# Altium schematic sheet [02] MCU.SchDoc
size A4; ApprovedBy: Laert Ferreira; Author: Deived Azevedo; CompanyName: Metro Rio; SheetNumber: 3; CurrentDate: 01/07/2024; ProjectName: CoreBoard
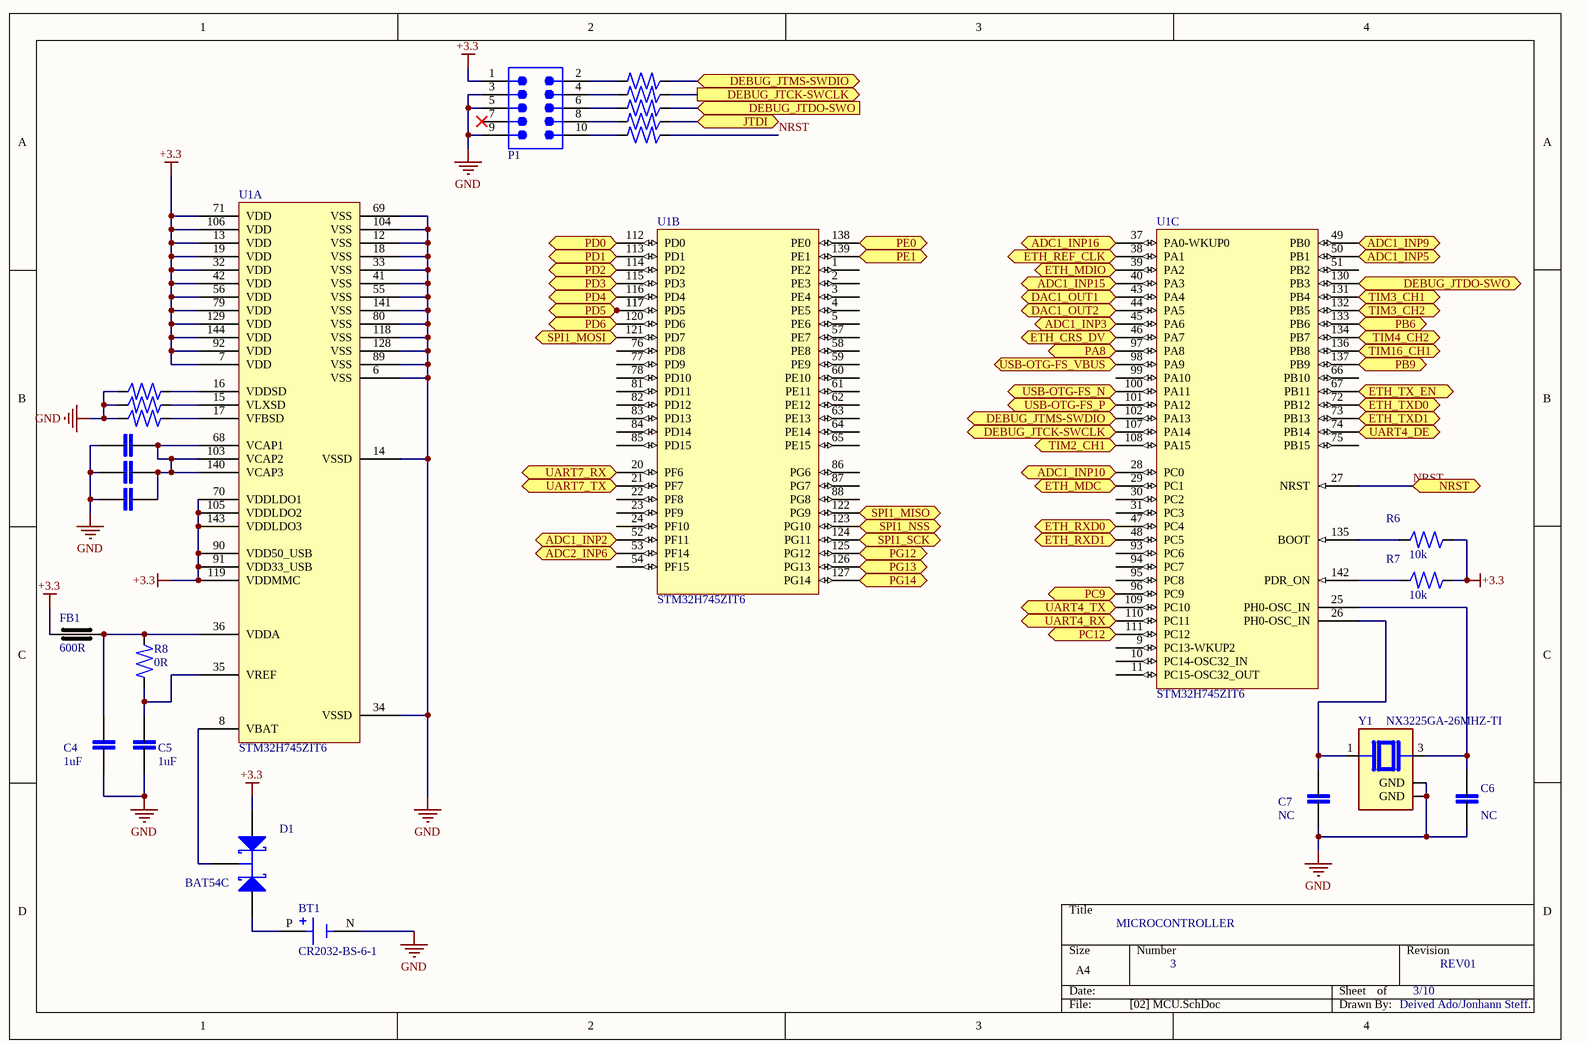
[diagram p0: [02] MCU.SchDoc]

## Parts
BT1  CR2032-BS-6-1  [BAT_CR2032-BS-6-1]
C1  2.2uF  [cap_0603]  (value not drawn)
C2  2.2uF  [cap_0603]  (value not drawn)
C3  2.2uF  [cap_0603]  (value not drawn)
C4  1uF  [cap_0603]
C5  1uF  [cap_0603]
C6  NC  [cap_0603]
C7  NC  [cap_0603]
D1  BAT54C  [SOT23_N]
FB1  600R  [cap_0603]
P1  62701020621  [SAMTEC-FTS-105-03-X-DV]  (value not drawn)
R1  22R  [RES_0603]  (value not drawn)
R2  22R  [RES_0603]  (value not drawn)
R3  22R  [RES_0603]  (value not drawn)
R4  22R  [RES_0603]  (value not drawn)
R5  22R  [RES_0603]  (value not drawn)
R6  10k  [res_0603]
R7  10k  [res_0603]
R8  0R  [res_0603]
R37  0R  [res_0603]  (value not drawn)
R38  0R  [res_0603]  (value not drawn)
R39  0R  [res_0603]  (value not drawn)
U1  STM32H745ZIT6  [LQFP144]  (parts A,B,C of 3)
Y1  NX3225GA-26MHZ-TI  [XTAL_NX3225SA-25.000M-STD-CRS-2]

## Ports
ADC1_INP2 (in), ADC1_INP3, ADC1_INP5 (in), ADC1_INP9 (in), ADC1_INP10 (in), ADC1_INP15, ADC1_INP16, ADC2_INP6 (in), DAC1_OUT1 (out), DAC1_OUT2 (out), DEBUG_JTCK-SWCLK (in), DEBUG_JTCK-SWCLK (out), DEBUG_JTDO-SWO (in), DEBUG_JTDO-SWO (out), DEBUG_JTMS-SWDIO, DEBUG_JTMS-SWDIO (bidir), ETH_CRS_DV, ETH_MDC (out), ETH_MDIO (bidir), ETH_REF_CLK (in), ETH_RXD0 (bidir), ETH_RXD1 (bidir), ETH_TX_EN (out), ETH_TXD0 (out), ETH_TXD1 (out), JTDI, NRST, PA8 (bidir), PB6 (bidir), PB9 (bidir), PC9 (bidir), PC12 (bidir), PD0 (bidir), PD1 (bidir), PD2 (bidir), PD3 (bidir), PD4 (bidir), PD5 (bidir), PD6 (bidir), PE0 (bidir), PE1 (bidir), PG12 (bidir), PG13 (bidir), PG14 (bidir), SPI1_MISO (in), SPI1_MOSI (out), SPI1_NSS (out), SPI1_SCK (out), TIM2_CH1 (out), TIM3_CH1 (out), TIM3_CH2 (out), TIM4_CH2 (out), TIM16_CH1 (out), UART4_DE (out), UART4_RX (in), UART4_TX (out), UART7_RX (in), UART7_TX (out), USB-OTG-FS_N (bidir), USB-OTG-FS_P (bidir), USB-OTG-FS_VBUS

## Nets
+3.3: D1.2(A2) FB1.1 P1.1 R6.1 R7.1 U1.7(VDD) U1.13(VDD) U1.19(VDD) U1.32(VDD) U1.42(VDD) U1.56(VDD) U1.70(VDDLDO1) U1.71(VDD) U1.79(VDD) U1.90(VDD50_USB) U1.91(VDD33_USB) U1.92(VDD) U1.105(VDDLDO2) U1.106(VDD) U1.119(VDDMMC) U1.129(VDD) U1.143(VDDLDO3) U1.144(VDD)
GND: BT1.N(NEG) C1.1 C2.1 C3.1 C4.1 C5.1 C6.1 C7.1 P1.3 P1.5 P1.9 R37.2 R38.2 R39.2 U1.6(VSS) U1.12(VSS) U1.14(VSSD) U1.18(VSS) U1.33(VSS) U1.34(VSSD) U1.41(VSS) U1.55(VSS) U1.69(VSS) U1.80(VSS) U1.89(VSS) U1.104(VSS) U1.118(VSS) U1.128(VSS) U1.141(VSS) Y1.2(GND) Y1.4(GND)
ADC1_INP2: U1.52(PF11) ; port ADC1_INP2
ADC1_INP3: U1.45(PA6) ; port ADC1_INP3
ADC1_INP5: U1.50(PB1) ; port ADC1_INP5
ADC1_INP9: U1.49(PB0) ; port ADC1_INP9
ADC1_INP10: U1.28(PC0) ; port ADC1_INP10
ADC1_INP15: U1.40(PA3) ; port ADC1_INP15
ADC1_INP16: U1.37(PA0-WKUP0) ; port ADC1_INP16
ADC2_INP6: U1.53(PF14) ; port ADC2_INP6
DAC1_OUT1: U1.43(PA4) ; port DAC1_OUT1
DAC1_OUT2: U1.44(PA5) ; port DAC1_OUT2
DEBUG_JTCK-SWCLK: R2.2 U1.107(PA14) ; port DEBUG_JTCK-SWCLK
DEBUG_JTDO-SWO: R3.2 U1.130(PB3) ; port DEBUG_JTDO-SWO
DEBUG_JTMS-SWDIO: R1.2 U1.102(PA13) ; port DEBUG_JTMS-SWDIO
ETH_CRS_DV: U1.46(PA7) ; port ETH_CRS_DV
ETH_MDC: U1.29(PC1) ; port ETH_MDC
ETH_MDIO: U1.39(PA2) ; port ETH_MDIO
ETH_REF_CLK: U1.38(PA1) ; port ETH_REF_CLK
ETH_RXD0: U1.47(PC4) ; port ETH_RXD0
ETH_RXD1: U1.48(PC5) ; port ETH_RXD1
ETH_TX_EN: U1.67(PB11) ; port ETH_TX_EN
ETH_TXD0: U1.72(PB12) ; port ETH_TXD0
ETH_TXD1: U1.73(PB13) ; port ETH_TXD1
JTDI: R4.2 ; port JTDI
NRST: R5.2 U1.27(NRST) ; port NRST
PA8: U1.97(PA8) ; port PA8
PB6: U1.133(PB6) ; port PB6
PB9: U1.137(PB9) ; port PB9
PC9: U1.96(PC9) ; port PC9
PC12: U1.111(PC12) ; port PC12
PD0: U1.112(PD0) ; port PD0
PD1: U1.113(PD1) ; port PD1
PD2: U1.114(PD2) ; port PD2
PD3: U1.115(PD3) ; port PD3
PD4: U1.116(PD4) ; port PD4
PD5: U1.117(PD5) ; port PD5
PD6: U1.120(PD6) ; port PD6
PE0: U1.138(PE0) ; port PE0
PE1: U1.139(PE1) ; port PE1
PG12: U1.125(PG12) ; port PG12
PG13: U1.126(PG13) ; port PG13
PG14: U1.127(PG14) ; port PG14
SPI1_MISO: U1.122(PG9) ; port SPI1_MISO
SPI1_MOSI: U1.121(PD7) ; port SPI1_MOSI
SPI1_NSS: U1.123(PG10) ; port SPI1_NSS
SPI1_SCK: U1.124(PG11) ; port SPI1_SCK
TIM2_CH1: U1.108(PA15) ; port TIM2_CH1
TIM3_CH1: U1.131(PB4) ; port TIM3_CH1
TIM3_CH2: U1.132(PB5) ; port TIM3_CH2
TIM4_CH2: U1.134(PB7) ; port TIM4_CH2
TIM16_CH1: U1.136(PB8) ; port TIM16_CH1
UART4_DE: U1.74(PB14) ; port UART4_DE
UART4_RX: U1.110(PC11) ; port UART4_RX
UART4_TX: U1.109(PC10) ; port UART4_TX
UART7_RX: U1.20(PF6) ; port UART7_RX
UART7_TX: U1.21(PF7) ; port UART7_TX
USB-OTG-FS_N: U1.100(PA11) ; port USB-OTG-FS_N
USB-OTG-FS_P: U1.101(PA12) ; port USB-OTG-FS_P
USB-OTG-FS_VBUS: U1.98(PA9) ; port USB-OTG-FS_VBUS
NetBT1_P: BT1.P(POS) D1.1(A1)
NetC1_2: C1.2 C2.2 C3.2 U1.68(VCAP1) U1.103(VCAP2) U1.140(VCAP3)
NetC4_2: C4.2 FB1.2 R8.2 U1.36(VDDA)
NetC5_2: C5.2 R8.1 U1.35(VREF)
NetC6_2: C6.2 U1.25(PH0-OSC_IN) Y1.3
NetC7_2: C7.2 U1.26(PH0-OSC_IN) Y1.1
NetD1_3: D1.3(K) U1.8(VBAT)
NetP1_2: P1.2 R1.1
NetP1_4: P1.4 R2.1
NetP1_6: P1.6 R3.1
NetP1_8: P1.8 R4.1
NetP1_10: P1.10 R5.1
NetR6_2: R6.2 U1.135(BOOT)
NetR7_2: R7.2 U1.142(PDR_ON)
NetR37_1: R37.1 U1.16(VDDSD)
NetR38_1: R38.1 U1.15(VLXSD)
NetR39_1: R39.1 U1.17(VFBSD)

Not connected (* = marked no-connect by the designer): P1 7*; U1 1(PE2) 2(PE3) 3(PE4) 4(PE5) 5(PE6) 9(PC13-WKUP2) 10(PC14-OSC32_IN) 11(PC15-OSC32_OUT) 22(PF8) 23(PF9) 24(PF10) 30(PC2) 31(PC3) 51(PB2) 54(PF15) 57(PE7) 58(PE8) 59(PE9) 60(PE10) 61(PE11) 62(PE12) 63(PE13) 64(PE14) 65(PE15) 66(PB10) 75(PB15) 76(PD8) 77(PD9) 78(PD10) 81(PD11) 82(PD12) 83(PD13) 84(PD14) 85(PD15) 86(PG6) 87(PG7) 88(PG8) 93(PC6) 94(PC7) 95(PC8) 99(PA10)

## Notes on the sheet
- MICROCONTROLLER
- 3
- 3/10
- REV01
- Deived Ado/Jonhann Steff.

## Library data of the parts
BT1 = CR2032-BS-6-1: Battery base CR2032 SMD Battery Connectors ROHS; MF: Shenzhen Q&J Electronics Co. Ltd; Package: Package; Check_prices: https://www.snapeda.com/parts/CR2032-BS-6-1/Shenzhen+Q%2526J+Electronics+Co.+Ltd/view-part/?ref=eda; SnapEDA_Link: https://www.snapeda.com/parts/CR2032-BS-6-1/Shenzhen+Q%2526J+Electronics+Co.+Ltd/view-part/?ref=snap; MP: CR2032-BS-6-1; Value: *; Availability: Not in stock; Price: None
C1-C7 = C_Small: Generic capacitor symbol
D1 = BAT54C: Schottky Barrier Double Diode; Published: 17-Sep-2003; LatestRevisionDate: 12-Dec-2006; LatestRevisionNote: IPC-7351 Footprint Added.; DatasheetVersion: 4-Mar-2002; PackageVersion: May-1999; PackageReference: SOT23; Publisher: Altium Limited; PackageDescription: 3-Pin SOT-23 Package 0.95 mm Pitch, 2.3 mm Lead Span; ComponentLink1Description: Manufacturer Link; ComponentLink1URL: http://www.semiconductors.philips.com/; ComponentLink2Description: Datasheet; ComponentLink2URL: http://www.semiconductors.philips.com/acrobat/datasheets/BAT54_SERIES_4.pdf
FB1 = FerriteBead_Small
P1 = 62701020621: WR-BHD Male Box Header, SMT Straight, pitch 1.27mm, 2 row, 10 pin; Manufacturer: Wurth Elektronik; Contact Resistance: 20mOhm; Insulation Resistance: 1000MOhm; Rated Current: 1A; Working Voltage: 50V; Withstanding Voltage: 500V; Manufacturer Part Number: 62701020621; Category: Wire-to-Board Connectors; Match Code: WR-BHD; ComponentLink1Description: Website Link; ComponentLink1URL: https://www.we-online.com/redexpert/article/62701020621?ad; ComponentLink2Description: Datasheet Link; ComponentLink2URL: https://www.we-online.com/redexpert/spec/62701020621?ad; Mount: Surface Mount; Operating Temperature Max: 105°C; Operating Temperature Min: -40°C; Packaging: Tape and Reel; Length: 12.7mm; Width: 5mm; Height: 5.3mm; Gender: Male; Number of Pins: 10; Number of Rows: 2; Orientation: Straight; Pitch: 1.27mm
R1-R8 R37-R39 = R_Small: Generic Resistor symbol
U1 = STM32H745ZIT6: High-performance and DSP with DP-FPU, Dual core Arm Cortex-M7+ Cortex-M4 MCU with 2MBytes of Flash memory, 1MB RAM, 480 MHz CPU, Art Accelerator, L1 cache, external memory interface, large set of peripherals, SMPS
Y1 = NX3225GA-26MHZ-TI: 26 MHz Â±20ppm Crystal 10pF 50 Ohms 4-SMD, No Lead; MF: NDK America,; SnapEDA_Link: https://www.snapeda.com/parts/NX3225GA-26MHZ-TI/NDK+America%252C+Inc./view-part/?ref=snap; Price: None; Purchase-URL: https://pricing.snapeda.com/search/part/NX3225GA-26MHZ-TI/?ref=eda; Value: *; MP: NX3225GA-26MHZ-TI; Availability: In Stock; Check_prices: https://www.snapeda.com/parts/NX3225GA-26MHZ-TI/NDK+America%252C+Inc./view-part/?ref=eda; Package: SMD-4 NDK